# Altium project PCB_ESP32.PrjPcb
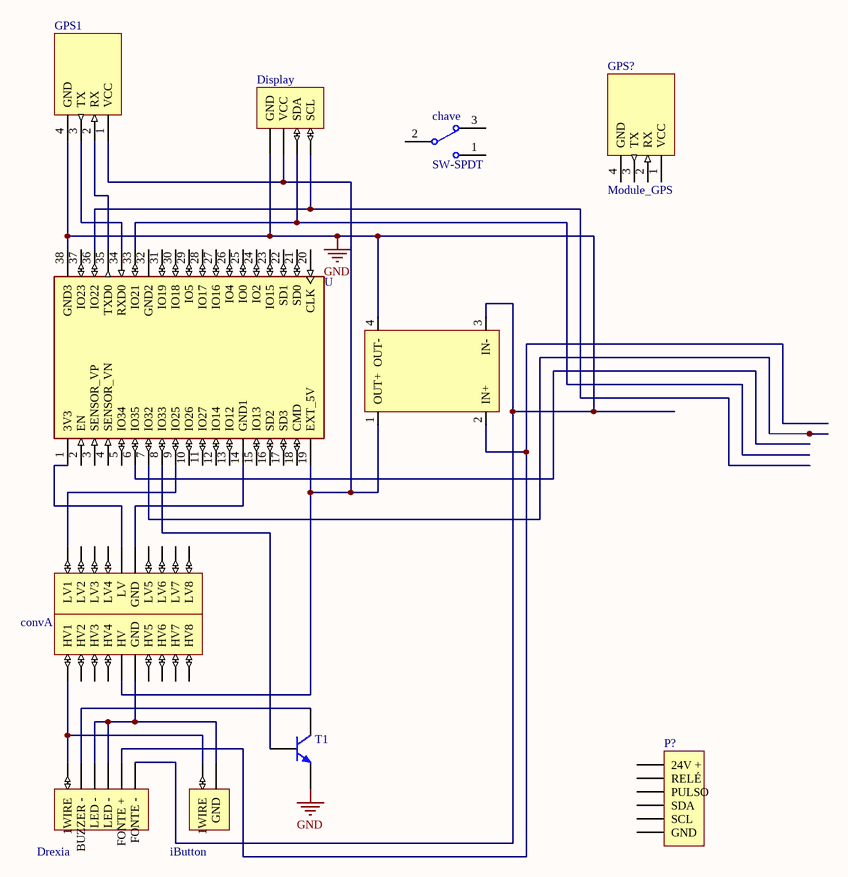
[diagram p0: Esquema_ESP32.SchDoc]
2 sheets, 12 parts. Net scope: global (net labels, ports and power ports of the same name join across sheets).
Board files: Board_ESP32.PcbDoc, Board_RaspberryPi.PcbDoc
Sheets:
  Esquema_ESP32.SchDoc
  Esquema_RaspberryPi.SchDoc

## Sheet Esquema_ESP32.SchDoc: PCB_ESP32
size A4; SheetNumber: 1; SheetTotal: 1; SPICEModelCacheOLNDSLWC: <root> / <DocumentId>OLNDSLWC</DocumentId> / <CacheFrame Number="0"> / <Model Name="npn" Kind="MDL"> / <Text>*Default NPN BJT / *NPN Trans Pinout: C,B,E / .MODEL NPN NPN()</Text> / </Model> / </CacheFrame> / </root>

### Parts
chave  SW-SPDT  [TL36WW15050]
convA  Header 10  [HDR1X10]  (value not drawn)
convB  Header 10  [HDR1X10]  (value not drawn)
Display  Header LCD  [HDR1X4]  (value not drawn)
Drexia  Header 6  [HDR1X6]  (value not drawn)
GPS1  Module_GPS  [Module_GPS]  (value not drawn)
GPS?  Module_GPS  [Module_GPS]
iButton  Header 2  [HDR1X2]  (value not drawn)
P?  Header 6  [HDR1X6]  (value not drawn)
REG1  Module_XL4005  [Module_XL4005]  (value not drawn)
T1  NPN  [TO-226-AA]  (value not drawn)
U  ESP32-DEVKITC  [MODULE_ESP32-DEVKITC]  (value not drawn)

### Nets
GND: Display.1(GND) Drexia.1(FONTE_-) GPS1.4(GND) REG1.3(IN-) REG1.4(OUT-) T1.3(E) U.38(GND3)
NetconvA_5: convA.5(GND) Drexia.3(LED_-) Drexia.4(LED_-) iButton.1(GND)
NetconvA_6: convA.6(HV) Display.2(VCC) GPS1.1(VCC) REG1.1(OUT+) U.19(EXT_5V)
NetconvA_10: convA.10(HV1) Drexia.6(1WIRE) iButton.2(1WIRE)
NetconvB_5: convB.5(GND) U.14(GND1)
NetconvB_6: convB.6(LV) U.1(3V3)
NetconvB_10: convB.10(LV1) U.9(IO25)
NetDisplay_3: Display.3(SDA) U.33(IO21)
NetDisplay_4: Display.4(SCL) U.36(IO22)
NetDrexia_2: Drexia.2(FONTE_+) REG1.2(IN+)
NetDrexia_5: Drexia.5(BUZZER_-) T1.1(C)
NetGPS1_2: GPS1.2(RX) U.35(TXD0)
NetGPS1_3: GPS1.3(TX) U.34(RXD0)
NetT1_2: T1.2(B) U.8(IO33)

Not connected (* = marked no-connect by the designer): chave 1 2 3; convA 1(HV8) 2(HV7) 3(HV6) 4(HV5) 7(HV4) 8(HV3) 9(HV2); convB 1(LV8) 2(LV7) 3(LV6) 4(LV5) 7(LV4) 8(LV3) 9(LV2); GPS? 1(VCC) 2(RX) 3(TX) 4(GND); P? 1(24V_+) 2(RELÉ) 3(PULSO) 4(SDA) 5(SCL) 6(GND); U 2(EN) 3(SENSOR_VP) 4(SENSOR_VN) 5(IO34) 6(IO35) 7(IO32) 10(IO26) 11(IO27) 12(IO14) 13(IO12) 15(IO13) 16(SD2) 17(SD3) 18(CMD) 20(CLK) 21(SD0) 22(SD1) 23(IO15) 24(IO2) 25(IO0) 26(IO4) 27(IO16) 28(IO17) 29(IO5) 30(IO18) 31(IO19) 32(GND2) 37(IO23)

### Library data of the parts
chave = SW-SPDT: SPDT Subminiature Toggle Switch, Right Angle Mounting, Vertical Actuation; Published: 24-Mar-1999; LatestRevisionDate: 17-Dec-2003; LatestRevisionNote: Schematic revised, PCB Footprint replaced.; DatasheetVersion: 05-Dec-2000; PackageReference: TL36WW15050; Publisher: Altium Limited; PackageDescription: Switch; 4 Leads; ComponentLink1Description: Manufacturer Link; ComponentLink1URL: http://www.apem.com
convA convB = Header 10: Header, 10-Pin; LatestRevisionDate: 17-Jul-2002; LatestRevisionNote: Re-released for DXP Platform.; Publisher: Altium Limited
Display = Header 4: Header, 4-Pin; LatestRevisionDate: 17-Jul-2002; LatestRevisionNote: Re-released for DXP Platform.; Publisher: Altium Limited
Drexia P? = Header 6: Header, 6-Pin; LatestRevisionDate: 17-Jul-2002; LatestRevisionNote: Re-released for DXP Platform.; Publisher: Altium Limited
GPS1 GPS? = Module_GPS: Module GPS
iButton = Header 2: Header, 2-Pin; LatestRevisionDate: 17-Jul-2002; LatestRevisionNote: Re-released for DXP Platform.; Publisher: Altium Limited
REG1 = Module_XL4005: Module XL4005 voltage regulator step down 5A
T1 = NPN: NPN Bipolar Transistor; Published: 8-Jun-2000; LatestRevisionDate: 17-Jul-2002; LatestRevisionNote: Re-released for DXP Platform.; PackageReference: TO-226-AA; Publisher: Altium Limited; PackageDescription: TO, Flat Index; 3 In-Line, Axial Leads; Body Dia. 4.8mm; Leads 0.55 x 0.51 mm (max); Code_JEDEC: TO-226-AA
U = ESP32-DEVKITC: - Transceiver; 802.11 b/g/n _Wi-Fi, WiFi, WLAN_, BluetoothÂ® Smart 4.x Low Energy _BLE_ For Use With ESP32-WROOM32; MF: Olimex LTD; Package: None; Price: None; Availability: Unavailable; MP: ESP32-DevKitC; SnapEDA_Link: https://www.snapeda.com/parts/ESP32-DevKitC/Olimex%20LTD/view-part/4219907/?ref=snap; Value: *

## Sheet Esquema_RaspberryPi.SchDoc
size A4; SheetNumber: 2; SheetTotal: 2